# EAGLE schematic simpleOscOne3 (EAGLE 7.7.0)
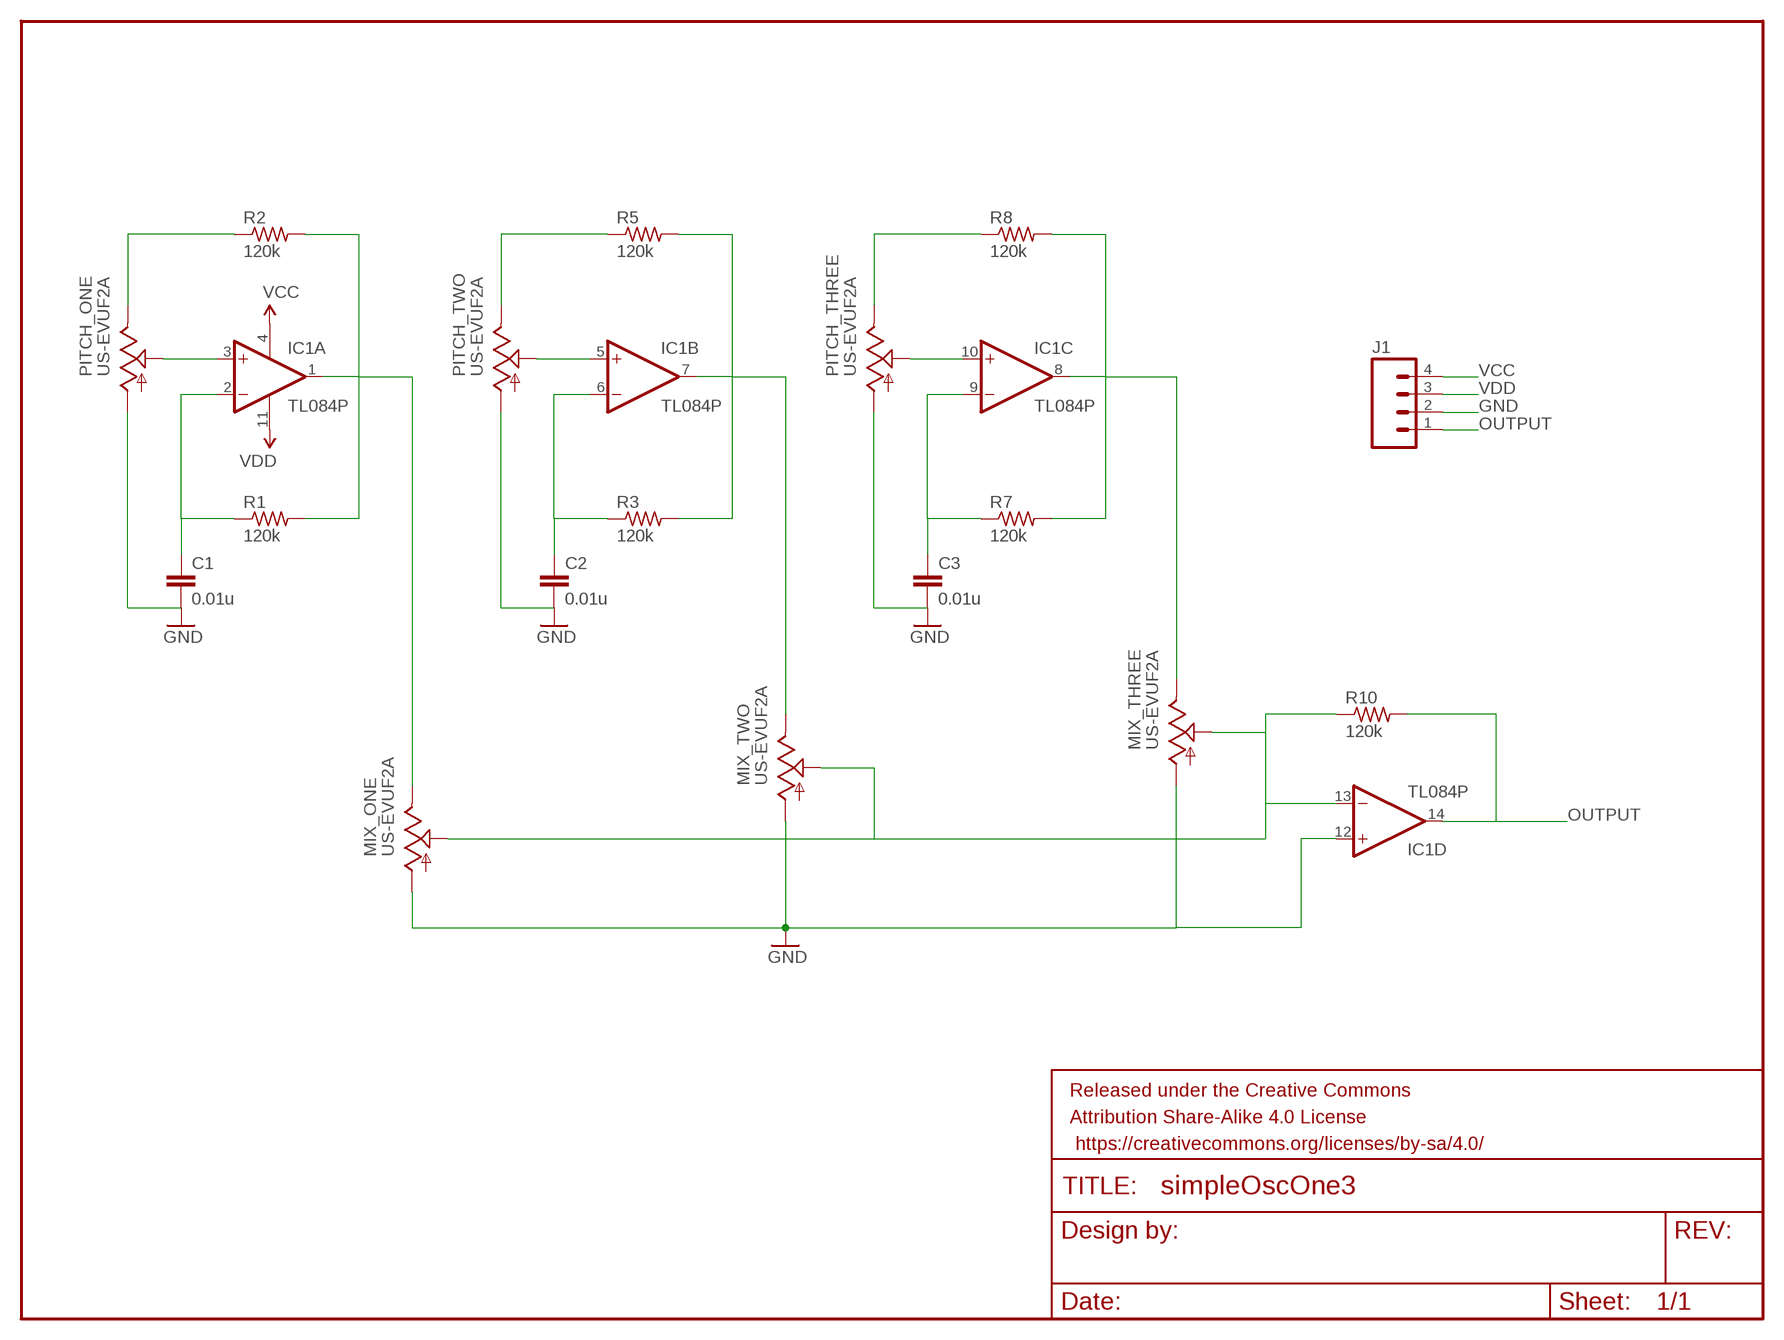
[diagram p0: schematic, sheet 1]

## Parts
C1  0.01u  CAP_  [AXIAL-5MM]
C2  0.01u  CAP_  [AXIAL-5MM]
C3  0.01u  CAP_  [AXIAL-5MM]
FRAME1  FRAME-LETTERNO_PACKAGE  [DUMMY]
IC1  TL084P  [DIL14]
J1  M04NO_SILK_ALL_ROUND  [1X04_NO_SILK_ALL_ROUND]
MIX_ONE  US-EVUF2A  [EVUF]
MIX_THREE  US-EVUF2A  [EVUF]
MIX_TWO  US-EVUF2A  [EVUF]
PITCH_ONE  US-EVUF2A  [EVUF]
PITCH_THREE  US-EVUF2A  [EVUF]
PITCH_TWO  US-EVUF2A  [EVUF]
R1  120k  R-US_0204/7  [0204/7]
R2  120k  R-US_0204/7  [0204/7]
R3  120k  R-US_0204/7  [0204/7]
R5  120k  R-US_0204/7  [0204/7]
R7  120k  R-US_0204/7  [0204/7]
R8  120k  R-US_0204/7  [0204/7]
R10  120k  R-US_0204/7  [0204/7]

## Nets
GND: C1.P$2 C2.P$2 C3.P$2 IC1.12(D:+IN) J1.2 MIX_ONE.1(A) MIX_THREE.1(A) MIX_TWO.1(A) PITCH_ONE.1(A) PITCH_THREE.1(A) PITCH_TWO.1(A)
N$1: PITCH_ONE.3(E) R2.1
N$2: IC1.1(A:OUT) MIX_ONE.3(E) R1.2 R2.2
N$3: IC1.7(B:OUT) MIX_TWO.3(E) R3.2 R5.2
N$4: IC1.3(A:+IN) PITCH_ONE.2(S)
N$5: C1.P$1 IC1.2(A:-IN) R1.1
N$6: PITCH_TWO.3(E) R5.1
N$7: IC1.5(B:+IN) PITCH_TWO.2(S)
N$8: C2.P$1 IC1.6(B:-IN) R3.1
N$9: IC1.8(C:OUT) MIX_THREE.3(E) R7.2 R8.2
N$10: PITCH_THREE.3(E) R8.1
N$11: IC1.10(C:+IN) PITCH_THREE.2(S)
N$12: C3.P$1 IC1.9(C:-IN) R7.1
N$14: IC1.13(D:-IN) MIX_ONE.2(S) MIX_THREE.2(S) MIX_TWO.2(S) R10.1
OUTPUT: IC1.14(D:OUT) J1.1 R10.2
VCC: IC1.4(P:V+) J1.4
VDD: IC1.11(P:V-) J1.3

## Library data of the parts
C1-C3 = SparkFun-Capacitors:CAP: Capacitor Standard 0603 ceramic capacitor, and 0.1" leaded capacitor.
FRAME1 = SparkFun-Aesthetics:FRAME-LETTER: Schematic Frame Standard 8.5x11 US Letter frame; DESIGNER: Nobody; VERSION: v01
IC1 = linear:TL084: OP AMP
J1 = SparkFun-Connectors:M04: Header 4 Standard 4-pin 0.1" header. Use with straight break away headers (SKU : PRT-00116), right angle break away headers (PRT-00553), swiss pins (PRT-00743), machine pins (PRT-00117), and female headers (PRT-00115). Molex polarized connector foot print use with SKU : PRT-08231 with associated crimp pins and housings. 1MM SMD Version SKU: PRT-10208; PROD_ID: CONN-09696
MIX_ONE MIX_THREE MIX_TWO PITCH_ONE PITCH_THREE PITCH_TWO = pot:US-EVU: 9 mm Square Rotary Potentiometers Source: Panasonic
R1-R3 R5 R7 R8 R10 = adafruit:R-US_: RESISTOR, American symbol

## Net classes
0 default: width 0.406 mm, clearance 0.305 mm